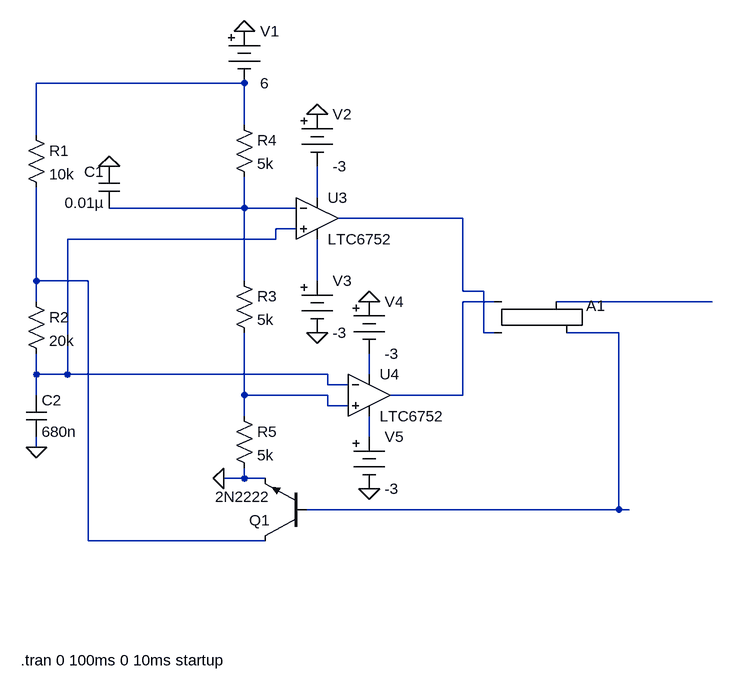
[diagram p0: schematic Astable.asc]
Astable.asc, the LTspice schematic file:
Version 4
SHEET 1 880 712
WIRE -128 -192 -448 -192
WIRE -128 -128 -128 -192
WIRE -448 -112 -448 -192
WIRE -16 -16 -16 -64
WIRE -128 0 -128 -48
WIRE -128 0 -336 0
WIRE -48 0 -128 0
WIRE 208 16 16 16
WIRE -48 32 -80 32
WIRE -80 48 -80 32
WIRE -80 48 -400 48
WIRE -448 112 -448 -32
WIRE -368 112 -448 112
WIRE -128 112 -128 0
WIRE -16 112 -16 48
WIRE 208 128 208 16
WIRE 240 128 208 128
WIRE -448 144 -448 112
WIRE 256 144 208 144
WIRE 592 144 352 144
WIRE 240 192 240 128
WIRE 256 192 240 192
WIRE 448 192 368 192
WIRE -448 256 -448 224
WIRE -400 256 -400 48
WIRE -400 256 -448 256
WIRE 0 256 -400 256
WIRE 64 256 64 224
WIRE 0 272 0 256
WIRE 32 272 0 272
WIRE -448 288 -448 256
WIRE -128 288 -128 192
WIRE 0 288 -128 288
WIRE 208 288 208 144
WIRE 208 288 96 288
WIRE 0 304 0 288
WIRE 32 304 0 304
WIRE -128 320 -128 288
WIRE 64 352 64 320
WIRE -448 368 -448 352
WIRE -128 416 -128 400
WIRE -128 416 -160 416
WIRE -96 416 -128 416
WIRE 448 464 448 192
WIRE 448 464 -32 464
WIRE 464 464 448 464
WIRE -368 512 -368 112
WIRE -96 512 -368 512
FLAG -448 368 0
FLAG -336 -64 0
FLAG -160 416 0
FLAG -16 192 0
FLAG 64 432 0
FLAG -128 -272 0
FLAG 64 144 0
FLAG -16 -144 0
SYMBOL cap -320 0 R180
WINDOW 0 24 56 Left 2
WINDOW 3 24 8 Left 2
SYMATTR InstName C1
SYMATTR Value 0.01µ
SYMATTR SpiceLine V=16 Irms=0 Rser=0.07047 Lser=690.6p mfg="Würth Elektronik" pn="885012208026 WCAP-CSGP 1206" type="X7R"
SYMBOL res -464 128 R0
SYMATTR InstName R2
SYMATTR Value 20k
SYMBOL npn -32 512 R180
SYMATTR InstName Q1
SYMATTR Value 2N2222
SYMBOL res -144 304 R0
SYMATTR InstName R5
SYMATTR Value 5k
SYMBOL res -144 96 R0
SYMATTR InstName R3
SYMATTR Value 5k
SYMBOL res -144 -144 R0
SYMATTR InstName R4
SYMATTR Value 5k
SYMBOL res -464 -128 R0
SYMATTR InstName R1
SYMATTR Value 10k
SYMBOL Digital\\srflop 304 96 R0
SYMATTR InstName A1
SYMBOL Misc\\battery -128 -288 R0
WINDOW 123 0 0 Left 0
WINDOW 39 0 0 Left 0
SYMATTR InstName V1
SYMATTR Value 6
SYMBOL cap -464 288 R0
SYMATTR InstName C2
SYMATTR Value 680n
SYMBOL Misc\\battery -16 -160 R0
WINDOW 123 0 0 Left 0
WINDOW 39 0 0 Left 0
SYMATTR InstName V2
SYMATTR Value -3
SYMBOL Misc\\battery -16 96 R0
WINDOW 123 0 0 Left 0
WINDOW 39 0 0 Left 0
SYMATTR InstName V3
SYMATTR Value -3
SYMBOL Misc\\battery 64 128 R0
WINDOW 123 0 0 Left 0
WINDOW 39 0 0 Left 0
SYMATTR InstName V4
SYMATTR Value -3
SYMBOL Misc\\battery 64 336 R0
WINDOW 123 0 0 Left 0
WINDOW 39 0 0 Left 0
SYMATTR InstName V5
SYMATTR Value -3
SYMBOL Comparators\\LTC6752 -16 -48 R0
SYMATTR InstName U3
SYMBOL Comparators\\LTC6752 64 224 R0
SYMATTR InstName U4
TEXT -472 696 Left 2 !.tran 0 100ms 0 10ms startup

The netlist it stands for:
* Astable.asc
C1 N003 0 0.01µ V=16 Irms=0 Rser=0.07047 Lser=690.6p mfg="Würth Elektronik" pn="885012208026 WCAP-CSGP 1206" type="X7R"
R2 N006 N005 20k
Q1 N006 N010 0 0 2N2222
R5 N012 0 5k
R3 N003 N012 5k
R4 N001 N003 5k
R1 N001 N006 10k
A1 N008 N004 0 0 0 N010 N009 0 SRFLOP
V1 0 N001 6
C2 N005 0 680n
V2 0 N002 -3
V3 N007 0 -3
V4 0 N011 -3
V5 N013 0 -3
XU3 N005 N003 N002 N007 N004 LTC6752  ; pins In+ In- V+ V- OUT
XU4 N012 N005 N011 N013 N008 LTC6752  ; pins In+ In- V+ V- OUT
.model NPN NPN
.model PNP PNP
.lib standard.bjt
.tran 0 100ms 0 10ms startup
.lib LTC7.lib
.backanno
.end